# Altium schematic sheet Sensor Base Schematic.SchDoc
size A; SheetNumber: 1; SheetTotal: 1
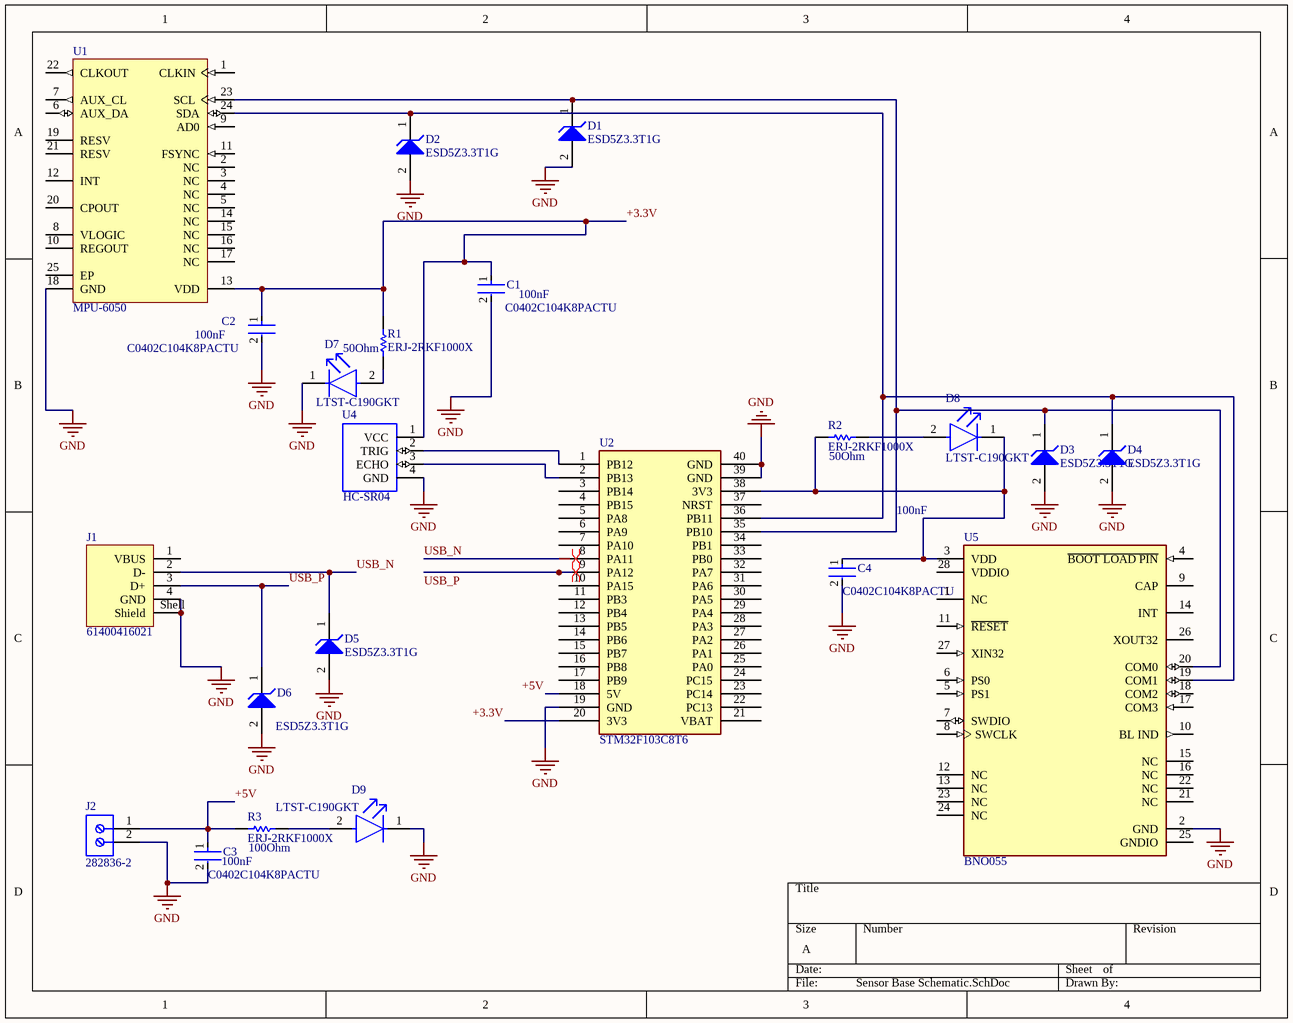
[diagram p0: Sensor Base Schematic.SchDoc]

## Parts
C1  C0402C104K8PACTU  [FP-C0402-BB-MFG]
C2  C0402C104K8PACTU  [FP-C0402-BB-MFG]
C3  C0402C104K8PACTU  [FP-C0402-BB-MFG]
C4  C0402C104K8PACTU  [FP-C0402-BB-MFG]
D1  ESD5Z3.3T1G  [ONSC-SOD-523-2-502-01_V]
D2  ESD5Z3.3T1G  [ONSC-SOD-523-2-502-01_V]
D3  ESD5Z3.3T1G  [ONSC-SOD-523-2-502-01_V]
D4  ESD5Z3.3T1G  [ONSC-SOD-523-2-502-01_V]
D5  ESD5Z3.3T1G  [ONSC-SOD-523-2-502-01_V]
D6  ESD5Z3.3T1G  [ONSC-SOD-523-2-502-01_V]
D7  LTST-C190GKT  [FP-LTST-C190GKT-MFG]
D8  LTST-C190GKT  [FP-LTST-C190GKT-MFG]
D9  LTST-C190GKT  [FP-LTST-C190GKT-MFG]
J1  61400416021  [61400416021]
J2  282836-2  [TECO-282836-2_V]
R1  ERJ-2RKF1000X  [RESC1005X40X25LL05T05]
R2  ERJ-2RKF1000X  [RESC1005X40X25LL05T05]
R3  ERJ-2RKF1000X  [RESC1005X40X25LL05T05]
U1  MPU-6050  [IS-QFN-24_V]
U2  STM32F103C8T6  [Stm32 BluePill]
U4  HC-SR04  [XCVR_HC-SR04]
U5  BNO055  [FP-BNO055-MFG]

## Nets
GND: C1.2 C2.2 C3.2 C4.2 D1.2(A) D2.2(A) D3.2(A) D4.2(A) D5.2(A) D6.2(A) D7.1(C) D9.1(C) J1.4(GND) J1.Shell(Shield) J2.2 U1.18(GND) U2.19(GND) U2.39(GND) U2.40(GND) U4.4(GND) U5.2(GND)
+3.3V: C1.1 C2.1 R1.2 U1.13(VDD) U2.20(3V3) U4.1(VCC)
+5V: C3.1 J2.1 R3.1 U2.18(5V)
USB_N: D5.1(K) J1.2(D-) U2.8(PA11)
USB_P: D6.1(K) J1.3(D+) U2.9(PA12)
NetC4_1: C4.1 D8.1(C) R2.1 U2.38(3V3) U5.3(VDD)
NetD1_1: D1.1(K) D3.1(K) U1.23(SCL) U2.35(PB10) U5.20(COM0)
NetD2_1: D2.1(K) D4.1(K) U1.24(SDA) U2.36(PB11) U5.19(COM1)
NetD7_2: D7.2(A) R1.1
NetD8_2: D8.2(A) R2.2
NetD9_2: D9.2(A) R3.2
NetU2_1: U2.1(PB12) U4.2(TRIG)
NetU2_2: U2.2(PB13) U4.3(ECHO)

Not connected (* = marked no-connect by the designer): J1 1(VBUS); U1 1(CLKIN) 2(NC) 3(NC) 4(NC) 5(NC) 6(AUX_DA) 7(AUX_CL) 8(VLOGIC) 9(AD0) 10(REGOUT) 11(FSYNC) 12(INT) 14(NC) 15(NC) 16(NC) 17(NC) 19(RESV) 20(CPOUT) 21(RESV) 22(CLKOUT) 25(EP); U2 3(PB14) 4(PB15) 5(PA8) 6(PA9) 7(PA10) 10(PA15) 11(PB3) 12(PB4) 13(PB5) 14(PB6) 15(PB7) 16(PB8) 17(PB9) 21(VBAT) 22(PC13) 23(PC14) 24(PC15) 25(PA0) 26(PA1) 27(PA2) 28(PA3) 29(PA4) 30(PA5) 31(PA6) 32(PA7) 33(PB0) 34(PB1) 37(NRST); U5 1(NC) 4(~{BOOT_LOAD_PIN}) 5(PS1) 6(PS0) 7(SWDIO) 8(SWCLK) 9(CAP) 10(BL_IND) 11(~{RESET}) 12(NC) 13(NC) 14(INT) 15(NC) 16(NC) 17(COM3) 18(COM2) 21(NC) 22(NC) 23(NC) 24(NC) 25(GNDIO) 26(XOUT32) 27(XIN32) 28(VDDIO)

## Layout directives
differential pair: USB_N, USB_P

## Notes on the sheet
- (near C1) 100nF
- 100nF
- (near R1) 50Ohm
- (near R2) 50Ohm
- (near C3) 100nF
- (near R3) 100Ohm

## Library data of the parts
C1-C4 = CMP-2008-02046-2: CAP CER 0.1UF 10V X5R 0402; Manufacturer: Kemet; Material: Ceramic; Capacitance: 0.10 μF; Temperature Coefficient: 15%; Tolerance: 0.1; Value: 0.10 μF; Package: C0402-BB; Temperature: -55°C to +125°C; ComponentLink2Description: Datasheet; Temperature Characteristic: X5R; Device Class L1: Passive Components; Height: 0.55mm; Lead Free: Yes; ComponentLink2URL: https://content.kemet.com/datasheets/KEM_C1002_X7R_SMD.pdf; Device Class L2: Capacitors; Temperature Range Low: -55°C; Temperature Range High: +125°C; RoHS: TRUE; Octopart: https://octopart.com/c0402c104k8pactu-kemet-140039; Automotive: No; Mouser Description: Capacitor 100 nF 10 VDC 0402; Category: Cap; Voltage Rating: 10 V; Digikey Description: CAP CER 0.1UF 10V X5R 0402; Ipc Land Pattern Name: CAPC10050X50; Device Class L3: Ceramic Capacitors; Manufacturer Part Number: C0402C104K8PACTU
D1-D6 = CMP-1063-00098-1: Transient Voltage Suppressor, Micro-Packaged Diode for ESD Protection, 2-Pin SOD-523, Pb-Free, Tape and Reel; Manufacturer: On Semiconductor; VRWM Max (V): 3.3; Number of Lines: 1; V(BR) Min (V): 5; PPK Max (W): 158; Direction: Unidirectional; IR Max (uA): 0.05; PackageReference: SOD-523-2-502-01; PackageVersion: Rev. E, 09/2010; RoHS: Pb-Free; ComponentLink3Description: Package Specification; Packing: Tape and Reel; ComponentLink1URL: http://www.onsemi.com/; DatasheetVersion: Rev. 10; ComponentLink2Description: Datasheet; Mounting Technology: Surface Mount; ComponentLink2URL: http://www.onsemi.cn/pub_link/Collateral/ESD5Z2.5T1-D.PDF; PartNumber: ESD5Z3.3T1G; PackageDescription: 2-Pin SOD, Body 1.2 x 0.8 mm; ComponentLink3URL: http://www.onsemi.com/pub_link/Collateral/502-01.PDF; ComponentLink1Description: Manufacturer URL
D7-D9 = CMP-22017-000005-2: LED GREEN CLEAR CHIP SMD; Dominant Wavelength: 569nm; Reverse Voltage: 5V; Lens Color: Colorless; Viewing Angle: 130°; Voltage: 2V; Forward Current: 30mA; Power Dissipation: 100mW; Luminous Intensity: 6mcd; Number of LEDs: 1; Forward Voltage: 2.1V; Wavelength: 565nm; Test Current: 10mA; Min Operating Temperature: -55°C; Lens Style: Clear; Mount: Surface Mount; Width: 0.8mm; Packaging: Tape and Reel; Lens Transparency: Clear; Case Code (Metric): 1608; Depth: 0.8mm; Case Code (Imperial): 0603; Case/Package: 0603; Number of Pins: 2; Max Operating Temperature: 85°C; Lead Free: Lead Free; Number of Elements: 1; Length: 1.6mm; Height: 0.8mm; Package Quantity: 1; Power Rating: 100mW; Radiation Hardening: No; Illumination Color: Green; Color: Green
J1 = CMP-1502-03227-2: NexarPartId: 21041530; Contact Resistance: 20mΩ; Gender: Receptacle; Voltage Rating (DC): 30V; Current Rating: 1.5A; Connector Type: USB; Insulation Resistance: 1GΩ; USB Standard: USB 2.0; Number of Contacts: 4; Number of Ports: 1; Width: 14.4mm; REACH SVHC: Unknown; Contact Plating: Gold; Length: 15.8mm; Lead Free: Lead Free; Max Operating Temperature: 105°C; Orientation: Horizontal; Contact Material: Copper; Voltage Rating: 30V; Min Operating Temperature: -40°C; Flammability Rating: UL94 V-0; Color: White; RoHS: Compliant; Number of Pins: 4; Mount: Horizontal, Through Hole; Number of Positions: 4; Operating Supply Voltage: 30V; Insulation Material: PBT; Termination: Solder
J2 = CMP-1684-00017-1: Female Header, Pitch 5 mm, 1 x 2 Position, Height 10 mm, Tail Length 3.5 mm, Rohs, Bulk; Manufacturer: TE Connectivity; Wire Gauge: 16-30AWG; Product Training Modules: Wire-to-BoardEurostyleTerminalBlocks; Clamp Material - Plating: Brass-NickelPlated; Voltage: 300V; Mating Orientation: HorizontalwithBoard; Current: 13.5A; Pitch: 0.197"(5.00mm); Screw Thread: M3; 3D Model: 282836-2.pdf; Other Names: 5ULV-02B / A98076; Dynamic Catalog: BuchananSeries; Number of Levels: 1; Torque - Screw: 0.68Nm(6Lb-In); Featured Product: EurostyleTerminalBlockConnectors; Positions Per Level: 2; Wire Termination: Screw-RisingCageClamp; Datasheet URL: http://www.te.com.cn/commerce/DocumentDelivery/DDEController?Action=showdoc&DocId=Catalog+Section%7F1308389_EUROSTYLE_TERMINAL_BLOCKS%7F0607%7Fpdf%7FEnglish%7FENG_CS_1308389_EUROSTYLE_TERMINAL_BLOCKS_0607.pdf%7F282836-2; Color: Green; Family: TerminalBlocks-WiretoBoard; RoHS Information: 282836-2StatementofCompliance; Standard Package: 300; Contact Material - Plating: Brass-TinPlated; Manufacturer URL: http://www.te.com; Housing Material: Polyamide(PA66),Nylon6/6; Features: Interlocking(Side); Package Description: Female Header, Pitch 5 mm, 1 x 2 Position, Height 10 mm, Tail Length 3.5 mm; Mounting Type: ThroughHole; Package Reference: THD; Packaging: Bulk; Series: Buchanan; Category: Connectors,Interconnects; Screw Material - Plating: Brass-NickelPlated
R1-R3 = CMP-2002-00605-3: Chip Resistor, 100 Ohm, +/- 1%, 100 mW, -55 to 155 degC, 0402 (1005 Metric), RoHS, Tape and Reel; Manufacturer: Basic Passives; Power Rating: 100 mW; Resistance: 100 Ohm; Voltage Rating: 50 V; Case\/Package: 0402; Width: 0.5 mm; Pins: 2; ComponentLink2Description: Datasheet; PackageReference: 0402; Height: 0.35 mm; Tolerance: 1%; DatasheetVersion: 04/2015; Case Code (Imperial): 0402; Min Operating Temperature: -55 degC; Radiation Hardening: No; Length: 1 mm; Package Quantity: 10000; PackageDescription: 2-Pin Surface Mount Device, Body 1 x 0.5 mm; Mounting Technology: Surface Mount; Case Code (Metric): 1005; Packaging: Tape and Reel; ComponentLink1URL: http://www.panasonic.com/; RoHSCompliant: true; Max Operating Temperature: 155 degC; REACH SVHC: Yes; PartNumber: ERJ-2RKF1000X; ComponentLink1Description: Manufacturer URL; ComponentLink2URL: http://industrial.panasonic.com/cdbs/www-data/pdf/RDA0000/AOA0000C86.pdf; Mount: Surface Mount
U1 = CMP-1753-00002-2: 3-Axis Gyroscope, Accelerometer and a Digital Motion Processor(TM) (DMP), 2.375 to 3.46 V, -40 to 85 degC, 24-Pin QFN, RoHS, Tape and Reel; Manufacturer: InvenSense; Featured Product: MPU-60506-Axis,IntegratedI²CSolution; Other Names: 1428-1007-2 / MPU6050; Sensor Type: MotionTracking; Online Catalog: MPU-6000™Series; Unit PriceUSD: Digital; Datasheet Version: Rev. 3.3, 05/2012; Category: Sensors,Transducers; Datasheet URL: http://datasheet.octopart.com/MPU-6050-InvenSense-datasheet-14421344.pdf; Family: Multifunction; Standard Package: 5,000; Manufacturer URL: http://www.invensense.com/; Output Type: Digital; Dynamic Catalog: MPU-6000™Series
U2 = BluePill: Designed By @Alixahedi
U4 = HC-SR04: Ultrasonic Sensor Module; Availability: Unavailable; MP: HC-SR04; Value: *; Price: None; Package: None
U5 = CMP-2000-05075-4: IMU ACCEL/GYRO/MAG I2C 28LGA; Sensor Type: Accelerometer; Packaging: Tape and Reel; Case/Package: LGA; Min Operating Temperature: -40°C; Mount: Surface Mount; Output Type: I2C; Lead Free: Lead Free; Max Operating Temperature: 85°C